# Altium schematic sheet DISPLAY.SchDoc
size A4
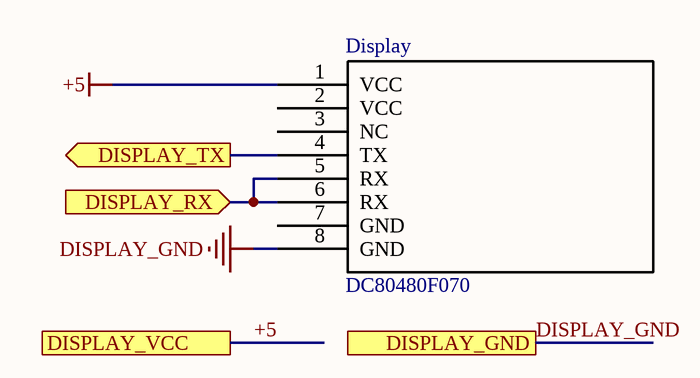
[diagram p0: DISPLAY.SchDoc]

## Parts
Display  DC80480F070

## Ports
DISPLAY_GND, DISPLAY_RX (in), DISPLAY_TX (out), DISPLAY_VCC

## Nets
+5: Display.1(VCC) ; port DISPLAY_VCC
DISPLAY_GND: Display.8(GND) ; port DISPLAY_GND
DISPLAY_RX: Display.5(RX) Display.6(RX) ; port DISPLAY_RX
DISPLAY_TX: Display.4(TX) ; port DISPLAY_TX

Not connected (* = marked no-connect by the designer): Display 2(VCC) 3(NC) 7(GND)